# EAGLE schematic flipdot-matrix (EAGLE 6.4)

## Sheet 1 of 2: Matrix
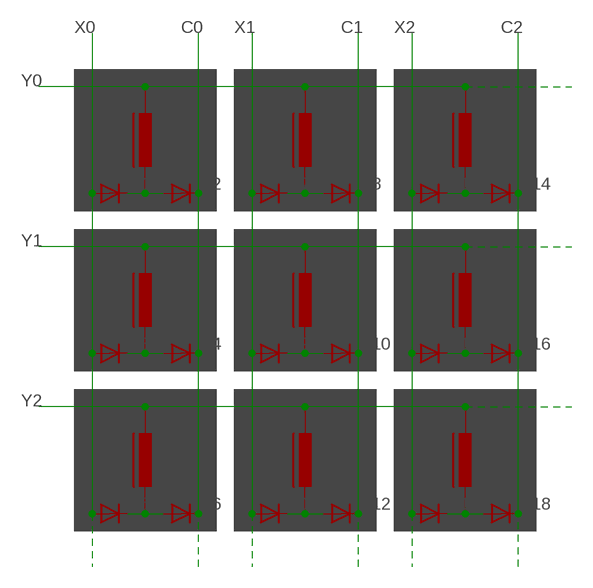
[diagram p0: schematic, sheet 1]

### Parts
D1  1N4004  [DO41-10]
D2  1N4004  [DO41-10]
D3  1N4004  [DO41-10]
D4  1N4004  [DO41-10]
D5  1N4004  [DO41-10]
D6  1N4004  [DO41-10]
D7  1N4004  [DO41-10]
D8  1N4004  [DO41-10]
D9  1N4004  [DO41-10]
D10  1N4004  [DO41-10]
D11  1N4004  [DO41-10]
D12  1N4004  [DO41-10]
D13  1N4004  [DO41-10]
D14  1N4004  [DO41-10]
D15  1N4004  [DO41-10]
D16  1N4004  [DO41-10]
D17  1N4004  [DO41-10]
D18  1N4004  [DO41-10]
L1  DS10  [DS10]
L2  DS10  [DS10]
L3  DS10  [DS10]
L4  DS10  [DS10]
L5  DS10  [DS10]
L6  DS10  [DS10]
L7  DS10  [DS10]
L8  DS10  [DS10]
L9  DS10  [DS10]

### Nets
C0: D2.C D4.C D6.C
C1: D8.C D10.C D12.C
C2: D14.C D16.C D18.C
N$2: D1.C D2.A L1.1
N$3: D3.C D4.A L2.1
N$4: D5.C D6.A L3.1
N$5: D7.C D8.A L4.1
N$6: D9.C D10.A L5.1
N$7: D11.C D12.A L6.1
N$8: D13.C D14.A L7.1
N$9: D15.C D16.A L8.1
N$12: D17.C D18.A L9.1
X0: D1.A D3.A D5.A
X1: D7.A D9.A D11.A
X2: D13.A D15.A D17.A
Y0: L1.2 L4.2 L7.2
Y1: L2.2 L5.2 L8.2
Y2: L3.2 L6.2 L9.2

## Sheet 2 of 2: Pixel
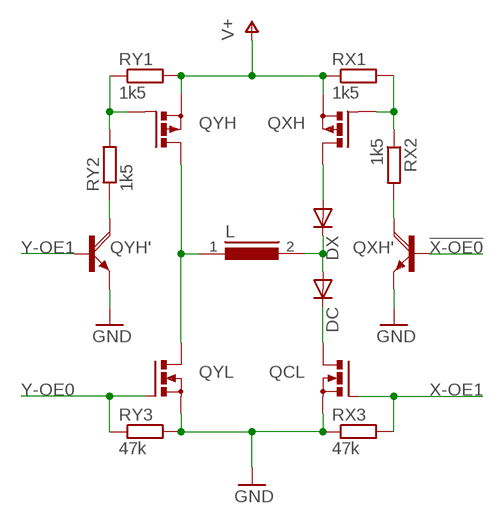
[diagram p1: schematic, sheet 2]

### Parts
DC  1N4004  [DO41-10]
DX  1N4004  [DO41-10]
L  DS10  [DS10]
QCL  PMOSFET_NTO220BV  [TO220BV]
QXH  PMOSFET_PTO220BV  [TO220BV]
QXH'  BD679  [TO126AV]
QYH  PMOSFET_PTO220BV  [TO220BV]
QYH'  BD679  [TO126AV]
QYL  PMOSFET_NTO220BV  [TO220BV]
RX1  1k5  R-EU_R0603  [R0603]
RX2  1k5  R-EU_R0603  [R0603]
RX3  47k  R-EU_R0603  [R0603]
RY1  1k5  R-EU_R0603  [R0603]
RY2  1k5  R-EU_R0603  [R0603]
RY3  47k  R-EU_R0603  [R0603]

### Nets
!X-OE0: QXH'.B
GND: QCL.S QXH'.E QYH'.E QYL.S RX3.1 RY3.2
N$1: QYH.G RY1.1 RY2.2
N$10: QYH'.C RY2.1
N$11: QXH'.C RX2.2
N$13: QXH.G RX1.2 RX2.1
N$23: L.1 QYH.D QYL.D
N$24: DX.A QXH.D
N$25: DC.A DX.C L.2
N$26: DC.C QCL.D
V+: QXH.S QYH.S RX1.1 RY1.2
X-OE1: QCL.G RX3.2
Y-OE0: QYL.G RY3.1
Y-OE1: QYH'.B

## Library data of the parts
D1-D18 DC DX = diode:1N4004: DIODE general purpose rectifier, 1 A
L L1-L9 = inductors:DS10: INDUCTOR
QCL QYL = transistor-power:PMOSFET_N: Power MOSFET N-Channel
QXH QYH = transistor-power:PMOSFET_P: Power MOSFET P-Channel
QXH' QYH' = transistor-power:BD679: NPN DARLINGTON TRANSISTOR
RX1-RX3 RY1-RY3 = resistor:R-EU_: RESISTOR, European symbol